# EAGLE design schematic (EAGLE 5.11)
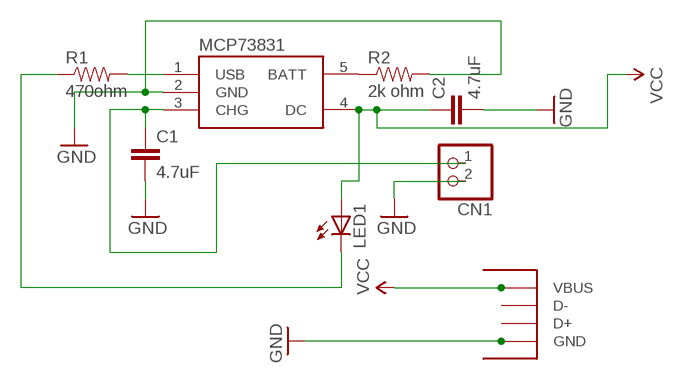
[diagram p0: schematic, sheet 1]

## Parts
C1  4.7uF  CAP0805  [0805]
C2  4.7uF  CAP0805  [0805]
CN1  JST_2PIN-THM  [JST-PH-2-THM]
LED1  LEDCHIP-LED0805  [CHIP-LED0805]
MCP73831  MAX1555  [SOT23-5]
R1  470ohm  RESISTOR  [0805]
R2  2k ohm  RESISTOR  [0805]
U$1  USBA_MALE  [USB_A_MALE]

## Nets
GND: C1.2 C2.2 CN1.2 MCP73831.2(GND) R2.2 U$1.GND
N$1: MCP73831.5(BATT) R2.1
N$3: C1.1 CN1.1 MCP73831.3(CHG)
N$4: LED1.C R1.1
N$5: MCP73831.1(USB) R1.2
VCC: C2.1 LED1.A MCP73831.4(DC) U$1.VBUS
Unconnected: U$1.D+ U$1.D-

## Library data of the parts
C1 C2 = SparkFun:CAP: Capacitor Standard 0603 ceramic capacitor, and 0.1" leaded capacitor.
CN1 = adafruit:JST_2PIN: JST 2-Pin Connectors of various flavors SMT-RA (S2B-PH-SM4) 4UConnector #17311 SMT (B2B-PH-SM4) THM-RA (S2B-PH) THM (B2B-PH)
LED1 = adafruit:LED: LED OSRAM: - CHIPLED LG R971, LG N971, LY N971, LG Q971, LY Q971, LO R971, LY R971 LH N974, LH R974 LS Q976, LO Q976, LY Q976 LO Q996 - Hyper CHIPLED LW Q18S LB Q993, LB Q99A, LB R99A - SideLED LS A670, LO A670, LY A670, LG A670, LP A670 LB A673, LV A673, LT A673, LW A673 LH A674 LY A675 LS A676, LA A676, LO A676, LY A676, LW A676 LS A679, LY A679, LG A679 - Hyper Micro SIDELED® LS Y876, LA Y876, LO Y876, LY Y876 LT Y87S - SmartLED LW L88C, LW L88S LB L89C, LB L89S, LG L890 LS L89K, LO L89K, LY L89K LS L896, LA L896, LO L896, LY L896 - TOPLED LS T670, LO T670, LY T670, LG T670, LP T670 LSG T670, LSP T670, LSY T670, LOP T670, LYG T670 LG T671, LOG T671, LSG T671 LB T673, LV T673, LT T673, LW T673 LH T674 LS T676, LA T676, LO T676, LY T676, LB T676, LH T676, LSB T676, LW T676 LB T67C, LV T67C, LT T67C, LS T67K, LO T67K, LY T67K, LW E67C LS E67B, LA E67B, LO E67B, LY E67B, LB E67C, LV E67C, LT E67C LW T67C LS T679, LY T679, LG T679 LS T770, LO T770, LY T770, LG T770, LP T770 LB T773, LV T773, LT T773, LW T773 LH T774 LS E675, LA E675, LY E675, LS T675 LS T776, LA T776, LO T776, LY T776, LB T776 LHGB T686 LT T68C, LB T68C - Hyper Mini TOPLED® LB M676 - Mini TOPLED Santana® LG M470 LS M47K, LO M47K, LY M47K Source: http://www.osram.convergy.de/
MCP73831 = SparkFun:MAX1555: MAX1555 Lithium Charger IC SOT-23 Lithium Polymer charging IC. Schematic element and footprint proven. Spark Fun Electronics SKU : COM-00674
R1 R2 = SparkFun:RESISTOR: Resistor Basic schematic elements and footprints for 0603, 1206, and PTH 1/10th watt (small) resistors.
U$1 = Ammon - usb pcb:USB

## Board
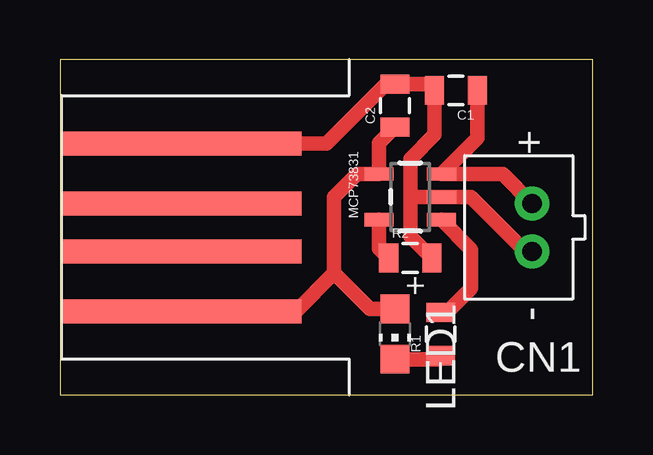
[diagram p1: board, top side]

Size 22.23 x 13.97 mm. Coordinates in mm from the lower left corner, seen from the top.
Outline: 0,0 22.23,0 22.23,13.97 0,13.97 0,0
Copper layers (1*16): Top 0.0356mm / dielectric 1.5011mm / Bottom 0.0356mm
Design rules "Dorkbot-PDX": minimum track width 6mil, minimum drill 13mil, track to track 6mil, track to pad 6mil, pad to pad 6mil, via to via 6mil, smd to smd 6mil, copper to edge 15mil, drill to drill 6mil, minimum pad ring 7mil, minimum via ring 7mil, stop-mask expansion 4mil, vias tented up to drill 0mil, thermal gap 10mil

### Footprints (pad centres in the part's own frame; a part is rotated, then mirrored left to right if it is on the bottom)
0805 = smd 0.8 x 1.2: 1 -0.9,0; 2 0.9,0
JST-PH-2-THM = drill 0.8 pad 1.422 round: 1 1,0; 2 -1,0
CHIP-LED0805 = smd 1.2 x 1.2: A 0,-1.05; C 0,1.05
SOT23-5 = smd 0.55 x 1.2: 1 -0.95,-1.3; 2 0,-1.3; 3 0.95,-1.3; 4 0.95,1.3; 5 -0.95,1.3
USB_A_MALE = smd 10 x 1: D+ 7,-1; D- 7,1; GND 7,-3.5; VBUS 7,3.5

### Placement (x,y rotation side)
C1  16.51,12.7 180 top
C2  13.97,12.06 90 top
CN1  19.68,6.99 90 top
LED1  13.97,2.54 180 top
MCP73831  14.61,8.26 90 top
R1  15.88,2.54 90 top
R2  14.61,5.71 0 top
U$1  12.06,6.99 180 top

### Tracks (layer width: path | path; a pad name or v marks a point on that pad's centre or on a via)
GND
  Top 0.61: U$1.GND 11.12,10.48 13.6,12.96 C2.2 15.35,12.96 C1.2 15.61,10.85 14.61,9.84 14.61,8.26 | 14.61,8.26 14.61,6.62 R2.2 | 14.61,8.26 MCP73831.2 17.14,8.26 19.41,5.99 CN1.2
N$1
  Top 0.61: R2.1 13.3,6.12 MCP73831.5
N$3
  Top 0.61: C1.1 17.41,10.71 MCP73831.3 18.46,9.21 CN1.1
N$4
  Top 0.61: LED1.C 15.72,1.49 R1.1
N$5
  Top 0.61: R1.2 16.14,3.44 17.14,4.45 17.14,6.07 MCP73831.1
VCC
  Top 0.61: U$1.VBUS 9.84,3.48 11.43,5.08 | 11.43,5.08 11.43,8.26 12.38,9.21 MCP73831.4 13.3,10.5 C2.1 | LED1.A 12.92,3.59 11.43,5.08